# Altium schematic sheet Sheet3.SchDoc: Flight Computer Prototype
size A4; Organization: Altium Limited; Address1: L3, 12a Rodborough Rd; Address2: Frenchs Forest; Address3: NSW; Address4: Australia 2086; Revision: 1.0; SheetNumber: 3; SheetTotal: 4
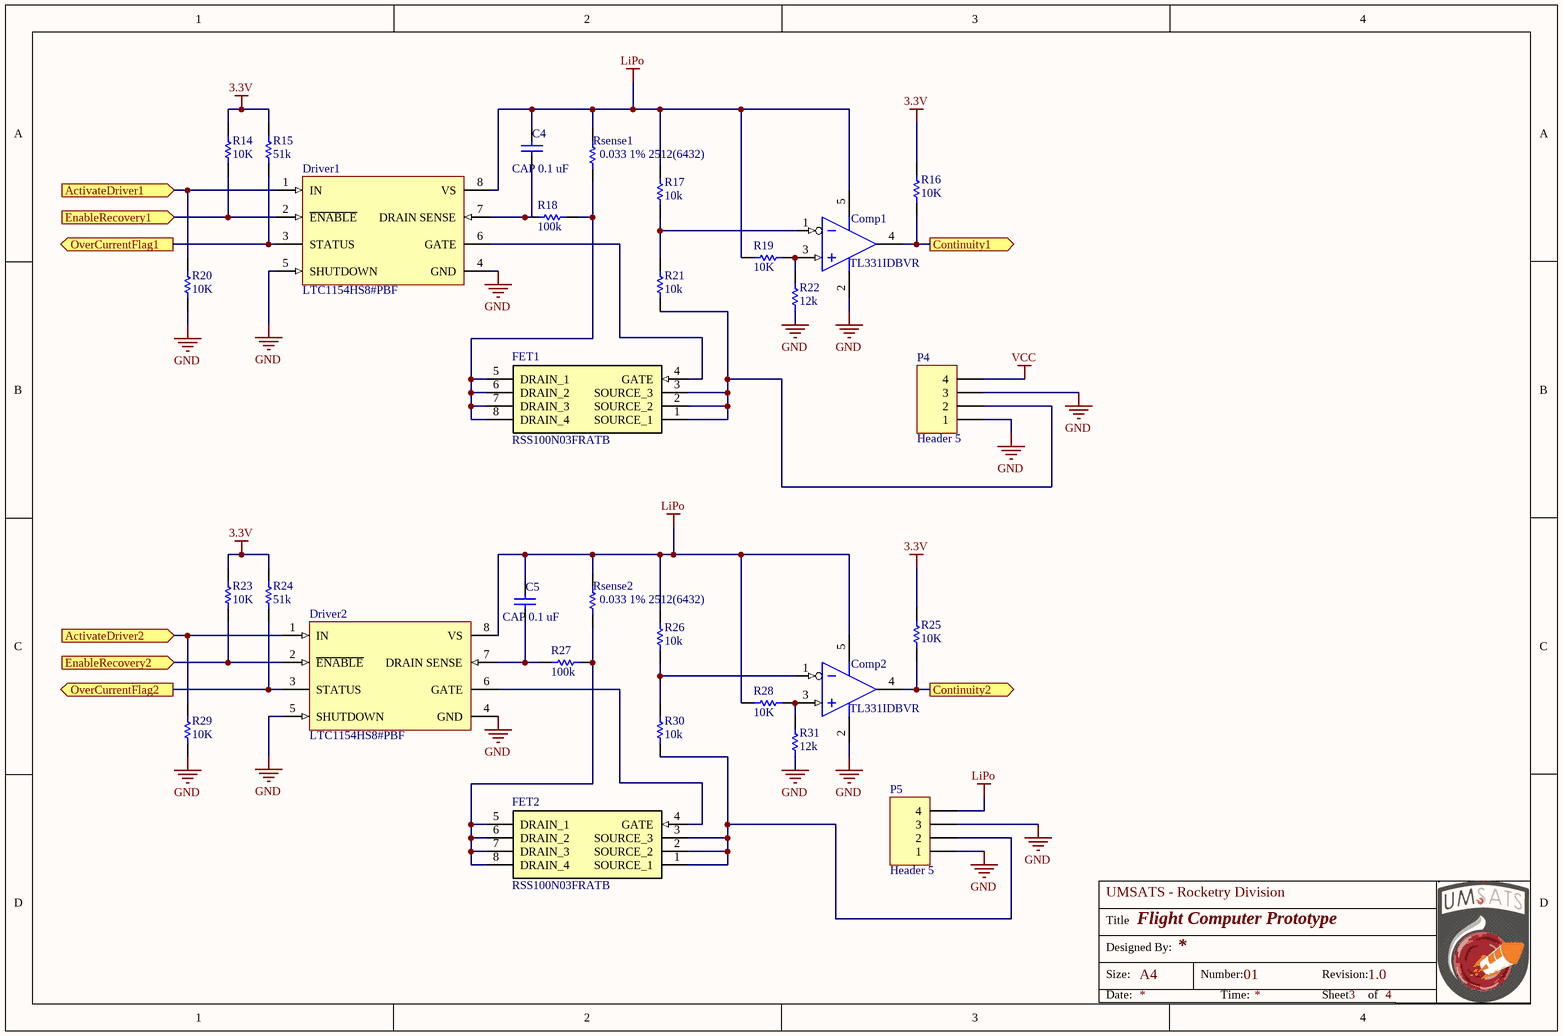
[diagram p0: Sheet3.SchDoc]

## Parts
C4  CAP 0.1 uF  [06035C104KAT4A]
C5  CAP 0.1 uF  [06035C104KAT4A]
Comp1  TL331IDBVR  [DBV0005A_M]
Comp2  TL331IDBVR  [DBV0005A_M]
Driver1  LTC1154HS8#PBF  [LT-S8-8_N]
Driver2  LTC1154HS8#PBF  [LT-S8-8_N]
FET1  RSS100N03FRATB  [SOIC127P600X165-8N]
FET2  RSS100N03FRATB  [SOIC127P600X165-8N]
P4  Header 5  [BarrierBlock]
P5  Header 5  [BarrierBlock]
R14  10K  [RK73H1JTTD1002F]
R15  51k  [RK73H1JTTD1002F]
R16  10K  [RK73H1JTTD1002F]
R17  10k  [RK73H1JTTD1002F]
R18  100k  [RK73H1JTTD1002F]
R19  10K  [RK73H1JTTD1002F]
R20  10K  [RK73H1JTTD1002F]
R21  10k  [RK73H1JTTD1002F]
R22  12k  [RK73H1JTTD1002F]
R23  10K  [RK73H1JTTD1002F]
R24  51k  [RK73H1JTTD1002F]
R25  10K  [RK73H1JTTD1002F]
R26  10k  [RK73H1JTTD1002F]
R27  100k  [RK73H1JTTD1002F]
R28  10K  [RK73H1JTTD1002F]
R29  10K  [RK73H1JTTD1002F]
R30  10k  [RK73H1JTTD1002F]
R31  12k  [RK73H1JTTD1002F]
Rsense1  0.033 1% 2512(6432)  [RESC2512(6432)_N]
Rsense2  0.033 1% 2512(6432)  [RESC2512(6432)_N]

## Ports
ActivateDriver1 (in), ActivateDriver2 (in), Continuity1 (out), Continuity2 (out), EnableRecovery1 (in), EnableRecovery2 (in), OverCurrentFlag1 (out), OverCurrentFlag2 (out)

## Nets
3.3V: R14.2 R15.2 R16.2 R23.2 R24.2 R25.2
GND: Comp1.2(VCC-/GND) Comp2.2(VCC-/GND) Driver1.4(GND) Driver1.5(SHUTDOWN) Driver2.4(GND) Driver2.5(SHUTDOWN) P4.1 P4.3 P5.1 P5.3 R20.1 R22.1 R29.1 R31.1
LiPo: C4.1 C5.1 Comp1.5(VCC) Comp2.5(VCC) Driver1.8(VS) Driver2.8(VS) P5.4 R17.2 R19.2 R26.2 R28.2 Rsense1.2 Rsense2.2
VCC: P4.4
ActivateDriver1: Driver1.1(IN) R20.2 ; port ActivateDriver1
ActivateDriver2: Driver2.1(IN) R29.2 ; port ActivateDriver2
Continuity1: Comp1.4(OUT) R16.1 ; port Continuity1
Continuity2: Comp2.4(OUT) R25.1 ; port Continuity2
EnableRecovery1: Driver1.2(~{ENABLE}) R14.1 ; port EnableRecovery1
EnableRecovery2: Driver2.2(~{ENABLE}) R23.1 ; port EnableRecovery2
OverCurrentFlag1: Driver1.3(STATUS) R15.1 ; port OverCurrentFlag1
OverCurrentFlag2: Driver2.3(STATUS) R24.1 ; port OverCurrentFlag2
NetC4_2: C4.2 Driver1.7(DRAIN_SENSE) R18.2
NetC5_2: C5.2 Driver2.7(DRAIN_SENSE) R27.2
NetComp1_1: Comp1.1(IN-) R17.1 R21.2
NetComp1_3: Comp1.3(IN+) R19.1 R22.2
NetComp2_1: Comp2.1(IN-) R26.1 R30.2
NetComp2_3: Comp2.3(IN+) R28.1 R31.2
NetDriver1_6: Driver1.6(GATE) FET1.4(GATE)
NetDriver2_6: Driver2.6(GATE) FET2.4(GATE)
NetFET1_1: FET1.1(SOURCE_1) FET1.2(SOURCE_2) FET1.3(SOURCE_3) P4.2 R21.1
NetFET1_5: FET1.5(DRAIN_1) FET1.6(DRAIN_2) FET1.7(DRAIN_3) FET1.8(DRAIN_4) R18.1 Rsense1.1
NetFET2_1: FET2.1(SOURCE_1) FET2.2(SOURCE_2) FET2.3(SOURCE_3) P5.2 R30.1
NetFET2_5: FET2.5(DRAIN_1) FET2.6(DRAIN_2) FET2.7(DRAIN_3) FET2.8(DRAIN_4) R27.1 Rsense2.1

## Notes on the sheet
- Title
- UMSATS - Rocketry Division
- Designed By:
- Size:
- A4
- Number:
- 01
- Revision:
- Date:
- Time:
- Sheet
- of

## Library data of the parts
C4 C5 = Cap: Capacitor; Published: 8-Jun-2000; LatestRevisionDate: 17-Jul-2002; LatestRevisionNote: Re-released for DXP Platform.; Publisher: Altium Limited
Comp1 Comp2 = CMP-2000-04959-1: Single Differential Comparator, 2 to 36 V, -40 to 125 degC, 5-Pin SOT-23, Green (RoHS & no Sb/Br), Tape and Reel; Manufacturer: TexasInstruments; Output Type: OpenCollector; Typical Voltage Gain: 106.02dB; Maximum Single Supply Voltage: 36V; Number of Channels per Chip: 1; Package Version: 4073253-4/N, 12/2014; Maximum Dual Supply Voltage: ±18V; Typical Response Time: 1.3us; Minimum Single Supply Voltage: 2V; Minimum Dual Supply Voltage: ±1V; Operating Temperature: -40to85degC; Category: Comparator; Datasheet Version: Rev. G, 02/2016; Strobe Capability: No; Rad Hard: No; Manufacturer URL: http://www.ti.com/; Datasheet URL: http://www.ti.com/general/docs/lit/getliterature.tsp?genericPartNumber=TL331&fileType=pdf; Packaging: Tape&Reel; Mounting: SurfaceMount; Rail to Rail: No; Package Reference: DBV5; Package: 5SOT-23; Package Description: 5-Pin Small Outline Transistor, Body 2.9 x 1.6 mm, Pitch 0.95 mm; Package URL: http://www.ti.com/lit/ml/mpds018l/mpds018l.pdf
Driver1 Driver2 = CMP-0479-00484-1: High-Side Micropower MOSFET Driver, 22 V Vin MAX, 8-pin SOIC (S8-8), -40 to 150 degC, Pb-Free; Manufacturer: Linear Technology; ComponentLink1Description: Manufacturer URL; DatasheetVersion: Rev. B; PackageDescription: 8-Pin Plastic Small Outline (Narrow .150 Inch), Body 4.9 x 3.9 mm, Pitch 1.27 mm; RoHS: TRUE; PartNumber: LTC1154HS8#PBF; PackageReference: S8-8; ComponentLink3Description: Package Specification; ComponentLink2URL: http://cds.linear.com/docs/en/datasheet/1154fb.pdf; Mounting Technology: Surface Mount; ComponentLink1URL: http://www.linear.com/; ComponentLink3URL: http://cds.linear.com/docs/en/packaging/05081610_G_SO8.pdf; ComponentLink2Description: Datasheet; PackageVersion: Rev. G, 03/2012
FET1 FET2 = RSS100N03FRATB: MOSFET (N-Channel); Manufacturer_Name: ROHM Semiconductor; Datasheet Link: https://componentsearchengine.com/Datasheets/1/RSS100N03FRATB.pdf; Height: 1.65mm; Manufacturer_Part_Number: RSS100N03FRATB; Mouser Part Number: 755-RSS100N03FRATB; Mouser Price/Stock: https://www.mouser.com/Search/Refine.aspx?Keyword=755-RSS100N03FRATB
P4 P5 = Header 4: Header, 4-Pin; LatestRevisionDate: 17-Jul-2002; LatestRevisionNote: Re-released for DXP Platform.; Publisher: Altium Limited
R14-R31 = Res1: Resistor; Value: 1K; Published: 8-Jun-2000; LatestRevisionDate: 17-Jul-2002; LatestRevisionNote: Re-released for DXP Platform.; PackageReference: AXIAL-0.3; Publisher: Altium Limited; PackageDescription: Axial Device, Thru-Hole; 2 Leads; 0.3 in Pin Spacing
Rsense1 Rsense2 = CMP-1018-00955-1: 8M66 1W 1% 2512 (6432 Metric)  SMD; Case-EIA: 2512; Case-Metric: 6432; Value: 8660000.00 Ohm; Power: 1 W; Technology: SMT; Tolerance: 1 %